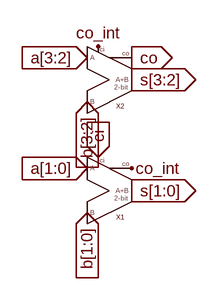
[diagram p0: schematic adder-4bit.asc]
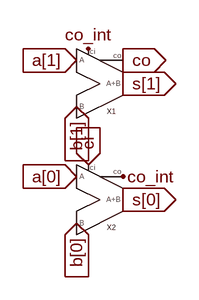
[diagram p1: sub-circuit adder-2bit.asc]
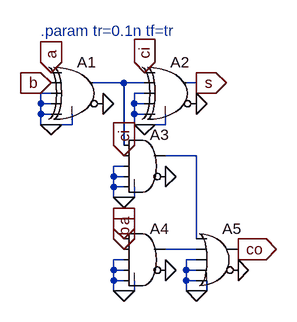
[diagram p2: sub-circuit adder.asc]
adder-4bit.asc, the LTspice schematic file:
Version 4
SHEET 1 880 680
FLAG 96 304 s[1:0]
IOPIN 96 304 Out
FLAG 96 144 s[3:2]
IOPIN 96 144 Out
FLAG 96 112 co
IOPIN 96 112 Out
FLAG 32 272 a[1:0]
IOPIN 32 272 In
FLAG 32 112 a[3:2]
IOPIN 32 112 In
FLAG 32 176 b[3:2]
IOPIN 32 176 In
FLAG 32 336 b[1:0]
IOPIN 32 336 In
FLAG 48 256 ci
IOPIN 48 256 In
FLAG 48 96 co_int
FLAG 96 272 co_int
SYMBOL adder-2bit 64 304 R0
SYMATTR InstName X1
SYMBOL adder-2bit 64 144 R0
SYMATTR InstName X2

adder-2bit.asc, the sub-circuit schematic file:
Version 4
SHEET 1 880 680
FLAG 128 288 s[0]
IOPIN 128 288 Out
FLAG 128 128 s[1]
IOPIN 128 128 Out
FLAG 128 96 co
IOPIN 128 96 Out
FLAG 64 256 a[0]
IOPIN 64 256 In
FLAG 64 96 a[1]
IOPIN 64 96 In
FLAG 64 160 b[1]
IOPIN 64 160 In
FLAG 64 320 b[0]
IOPIN 64 320 In
FLAG 80 240 ci
IOPIN 80 240 In
FLAG 128 256 co_int
FLAG 80 80 co_int
SYMBOL adder 96 128 R0
SYMATTR InstName X1
SYMBOL adder 96 288 R0
SYMATTR InstName X2

adder.asc, the sub-circuit schematic file:
Version 4
SHEET 1 880 680
WIRE -208 32 -256 32
WIRE -176 32 -208 32
WIRE -96 32 -112 32
WIRE -320 48 -336 48
WIRE -176 48 -192 48
WIRE -336 64 -336 48
WIRE -320 64 -336 64
WIRE -192 64 -192 48
WIRE -176 64 -192 64
WIRE -336 80 -336 64
WIRE -320 80 -336 80
WIRE -192 80 -192 64
WIRE -176 80 -192 80
WIRE -336 96 -336 80
WIRE -320 96 -336 96
WIRE -288 96 -288 80
WIRE -288 96 -320 96
WIRE -192 96 -192 80
WIRE -176 96 -192 96
WIRE -144 96 -144 80
WIRE -144 96 -176 96
WIRE -208 128 -208 32
WIRE -96 144 -144 144
WIRE -208 160 -224 160
WIRE -224 176 -224 160
WIRE -208 176 -224 176
WIRE -224 192 -224 176
WIRE -208 192 -224 192
WIRE -224 208 -224 192
WIRE -208 208 -224 208
WIRE -192 208 -192 192
WIRE -192 208 -208 208
WIRE -96 272 -96 144
WIRE -96 288 -144 288
WIRE -208 304 -224 304
WIRE -96 304 -112 304
WIRE -224 320 -224 304
WIRE -208 320 -224 320
WIRE -112 320 -112 304
WIRE -96 320 -112 320
WIRE -224 336 -224 320
WIRE -208 336 -224 336
WIRE -112 336 -112 320
WIRE -96 336 -112 336
WIRE -224 352 -224 336
WIRE -208 352 -224 352
WIRE -192 352 -192 336
WIRE -192 352 -208 352
WIRE -112 352 -112 336
WIRE -96 352 -112 352
WIRE -80 352 -80 336
WIRE -80 352 -96 352
FLAG -96 32 s
IOPIN -96 32 Out
FLAG -320 32 b
IOPIN -320 32 In
FLAG -320 16 a
IOPIN -320 16 In
FLAG -320 96 0
FLAG -240 64 0
FLAG -176 96 0
FLAG -176 16 ci
IOPIN -176 16 In
FLAG -208 208 0
FLAG -144 176 0
FLAG -208 144 ci
IOPIN -208 144 In
FLAG -208 352 0
FLAG -144 320 0
FLAG -208 288 b
IOPIN -208 288 In
FLAG -208 272 a
IOPIN -208 272 In
FLAG -96 352 0
FLAG -32 288 co
IOPIN -32 288 Out
FLAG -96 64 0
FLAG -32 320 0
SYMBOL Digital\\xor -272 -16 R0
SYMATTR InstName A1
SYMBOL Digital\\and -176 96 R0
SYMATTR InstName A3
SYMBOL Digital\\or -64 240 R0
SYMATTR InstName A5
SYMBOL Digital\\xor -128 -16 R0
SYMATTR InstName A2
SYMBOL Digital\\and -176 240 R0
SYMATTR InstName A4
TEXT -336 -48 Left 2 ;.param tr=0.1n tf=tr

The netlist it stands for:
* adder-4bit.asc
XX1 a[1] a[0] b[1] b[0] ci co_int s[1] s[0] adder-2bit
XX2 a[3] a[2] b[3] b[2] co_int co s[3] s[2] adder-2bit

* block symbol definitions
.subckt adder-2bit a[1] a[0] b[1] b[0] ci co s[1] s[0]
XX1 a[1] b[1] co_int co s[1] adder
XX2 a[0] b[0] ci co_int s[0] adder
.ends adder-2bit

.subckt adder a b ci co s
A1 a b 0 0 0 0 N001 0 XOR
A3 N001 ci 0 0 0 0 N002 0 AND
A5 N002 N003 0 0 0 0 co 0 OR
A2 ci N001 0 0 0 0 s 0 XOR
A4 a b 0 0 0 0 N003 0 AND
* .param tr=0.1n tf=tr
.ends adder

.backanno
.end